# EAGLE design main (EAGLE 6.6.0)
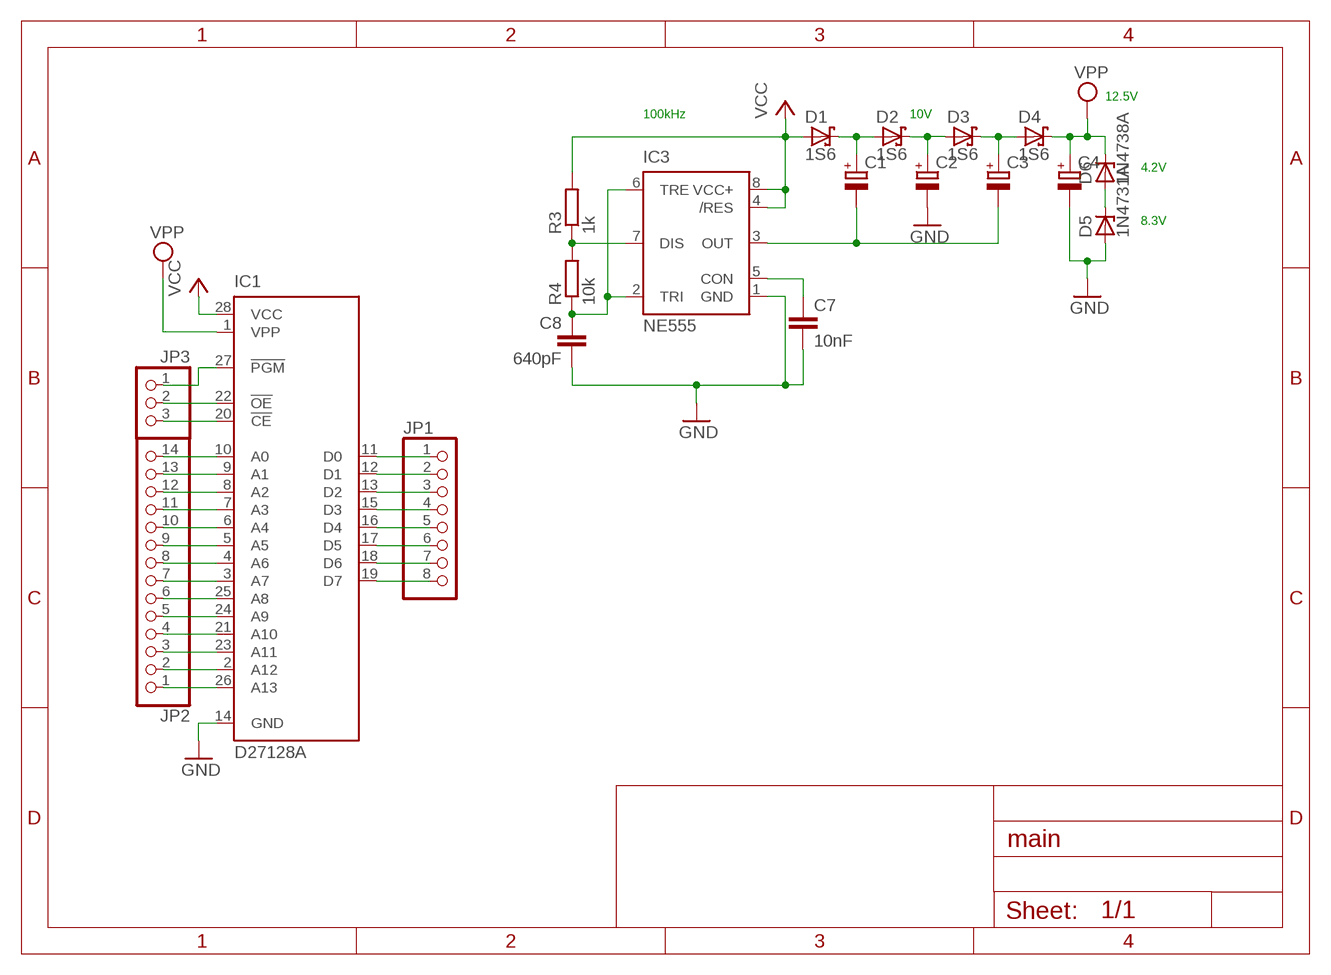
[diagram p0: schematic, sheet 1]

## Parts
C1  CPOL-EUB45181A  [B45181A]
C2  CPOL-EUB45181A  [B45181A]
C3  CPOL-EUB45181A  [B45181A]
C4  CPOL-EUB45181A  [B45181A]
C7  10nF  C-EU025-025X050  [C025-025X050]
C8  640pF  C-EU025-025X050  [C025-025X050]
D1  1S6  1N5817-B  [DO41-7.6]
D2  1S6  1N5817-B  [DO41-7.6]
D3  1S6  1N5817-B  [DO41-7.6]
D4  1S6  1N5817-B  [DO41-7.6]
D5  1N4731A  1N4728  [DO41Z10]
D6  1N4738A  1N4728  [DO41Z10]
IC1  D27128A  27C128P  [DIL28-6]
IC3  NE555  [DIL-08]
JP1  PINHD-1X8  [1X08]
JP2  PINHD-1X14  [1X14]
JP3  PINHD-1X3  [1X03]
R3  1k  R-EU_0204/7  [0204/7]
R4  10k  R-EU_0204/7  [0204/7]

## Nets
GND: C2.- C4.- C7.2 C8.2 D5.A IC1.14(GND) IC3.1(GND)
N$1: IC1.11(D0) JP1.1
N$2: IC1.12(D1) JP1.2
N$3: IC1.13(D2) JP1.3
N$4: IC1.15(D3) JP1.4
N$5: IC1.16(D4) JP1.5
N$6: IC1.17(D5) JP1.6
N$7: IC1.18(D6) JP1.7
N$8: IC1.19(D7) JP1.8
N$9: IC1.10(A0) JP2.14
N$10: IC1.9(A1) JP2.13
N$11: IC1.8(A2) JP2.12
N$12: IC1.7(A3) JP2.11
N$13: IC1.6(A4) JP2.10
N$14: IC1.5(A5) JP2.9
N$15: IC1.4(A6) JP2.8
N$16: IC1.3(A7) JP2.7
N$17: IC1.25(A8) JP2.6
N$18: IC1.24(A9) JP2.5
N$19: IC1.21(A10) JP2.4
N$20: IC1.23(A11) JP2.3
N$21: IC1.2(A12) JP2.2
N$22: IC1.26(A13) JP2.1
N$23: C1.- C3.- IC3.3(OUT)
N$24: C3.+ D3.C D4.A
N$25: IC1.20(!CE) JP3.3
N$27: D5.C D6.A
N$28: IC1.22(!OE) JP3.2
N$29: IC1.27(!PGM) JP3.1
N$30: C7.1 IC3.5(CON)
N$32: C8.1 IC3.2(TRI) IC3.6(TRE) R4.1
N$34: C1.+ D1.C D2.A
N$36: C2.+ D2.C D3.A
N$40: IC3.7(DIS) R3.1 R4.2
VCC: D1.A IC1.28(VCC) IC3.4(/RES) IC3.8(VCC+) R3.2
VPP: C4.+ D4.C D6.C IC1.1(VPP)

## Notes on the sheet
- 12.5V
- 100kHz | 10V
- 4.2V
- 8.3V

## Library data of the parts
C1-C4 = rcl:CPOL-EU: POLARIZED CAPACITOR, European symbol
C7 C8 = rcl:C-EU: CAPACITOR, European symbol
D1-D4 = diode:1N581*: 1.0A SCHOTTKY BARRIER RECTIFIER Source: http://www.diodes.com/datasheets/ds23001.pdf
D5 D6 = diode:1N4728: Z DIODE 3.3 V, 1W, 5 percent
IC1 = microchip:27*128: CMOS EPROM 128 K (16 K x 8); OC_FARNELL: unknown; OC_NEWARK: unknown
IC3 = st-microelectronics:NE555: General purpose bipolar Timer; MF: Arrow Electronics; MPN: NE555N; OC_FARNELL: 1467742; OC_NEWARK: 89K1486
JP1 = pinhead:PINHD-1X8: PIN HEADER
JP2 = pinhead:PINHD-1X14: PIN HEADER
JP3 = pinhead:PINHD-1X3: PIN HEADER
R3 R4 = rcl:R-EU_: RESISTOR, European symbol

## Board
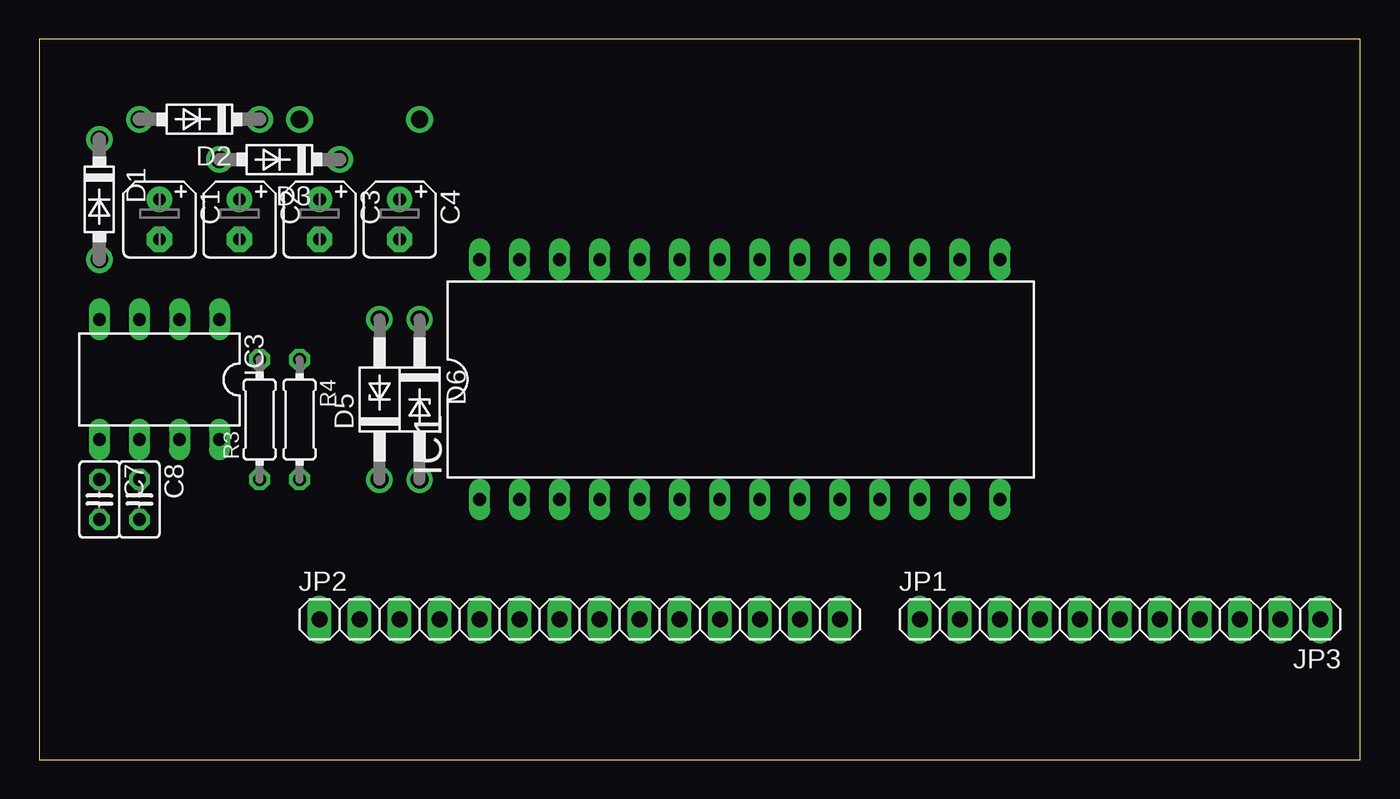
[diagram p1: board, top side]
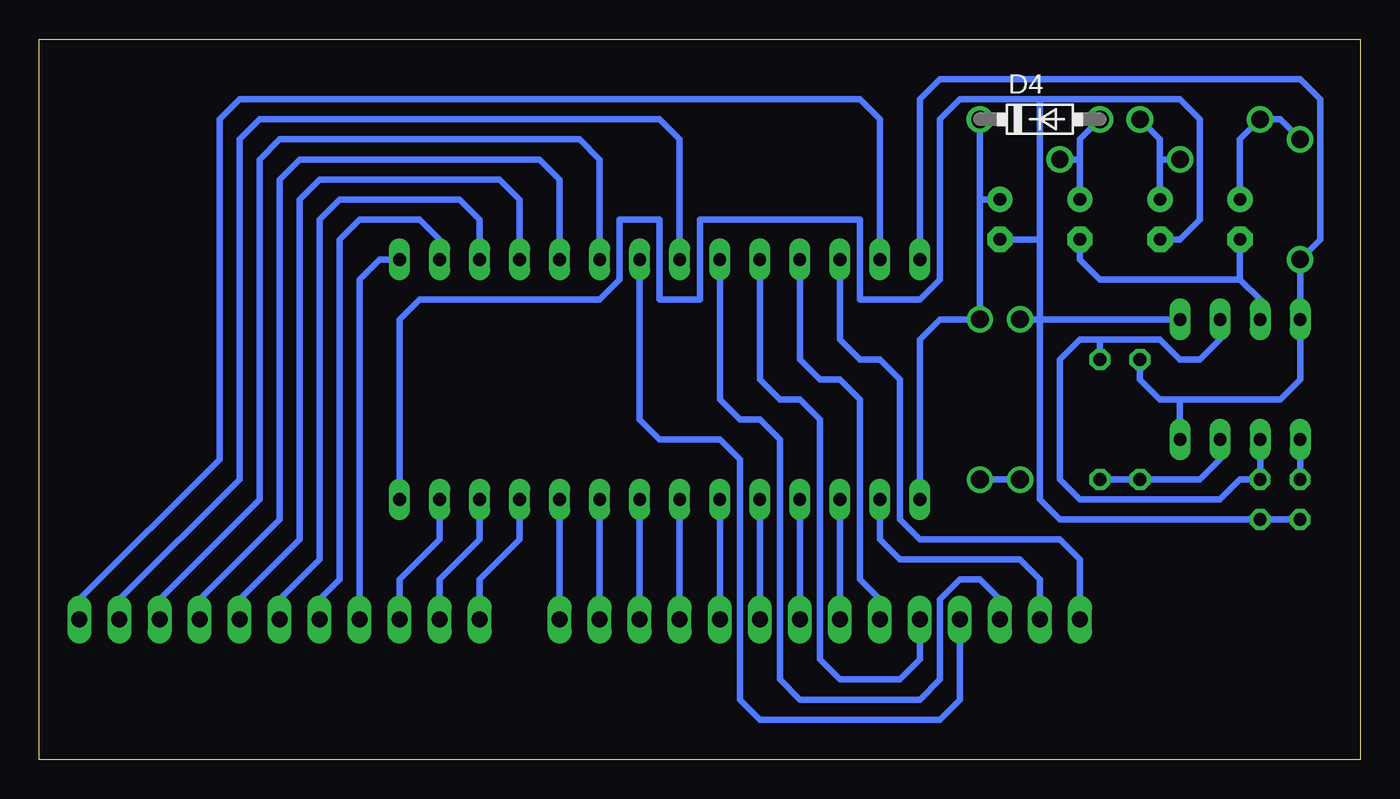
[diagram p2: board, bottom side, seen from below]

Size 83.82 x 45.72 mm. Coordinates in mm from the lower left corner, seen from the top.
Outline: 0,0 83.82,0 83.82,45.72 0,45.72 0,0
Copper layers (1*16): Top 0.035mm / dielectric 1.5mm / Bottom 0.035mm
Design rules "default": minimum track width 10mil, minimum drill 24mil, track to track 8mil, track to pad 8mil, pad to pad 8mil, via to via 8mil, smd to smd 8mil, copper to edge 40mil, drill to drill 8mil, minimum pad ring 10mil, minimum via ring 8mil, stop-mask expansion 4mil, vias tented up to drill 0mil, thermal gap 10mil

### Footprints (pad centres in the part's own frame; a part is rotated, then mirrored left to right if it is on the bottom)
B45181A = drill 0.813 pad 1.6: + -1.27,0 | drill 0.813 pad 1.6 octagon: - 1.27,0
C025-025X050 = drill 0.813 octagon: 1 -1.27,0; 2 1.27,0
DO41-7.6 = drill 1.1 pad 1.7: A 3.81,0; C -3.81,0
DO41Z10 = drill 1.118: A 5.08,0; C -5.08,0
DIL28-6 = drill 0.813 long: 1 -16.51,-7.62; 2 -13.97,-7.62; 3 -11.43,-7.62; 4 -8.89,-7.62; 5 -6.35,-7.62; 6 -3.81,-7.62; 7 -1.27,-7.62; 8 1.27,-7.62; 9 3.81,-7.62; 10 6.35,-7.62; 11 8.89,-7.62; 12 11.43,-7.62; 13 13.97,-7.62; 14 16.51,-7.62; 15 16.51,7.62; 16 13.97,7.62; 17 11.43,7.62; 18 8.89,7.62; 19 6.35,7.62; 20 3.81,7.62; 21 1.27,7.62; 22 -1.27,7.62; 23 -3.81,7.62; 24 -6.35,7.62; 25 -8.89,7.62; 26 -11.43,7.62; 27 -13.97,7.62; 28 -16.51,7.62
DIL-08 = drill 0.813 long: 1 -3.81,-3.81; 2 -1.27,-3.81; 3 1.27,-3.81; 4 3.81,-3.81; 5 3.81,3.81; 6 1.27,3.81; 7 -1.27,3.81; 8 -3.81,3.81
1X08 = drill 1.016 long: 1 -8.89,0; 2 -6.35,0; 3 -3.81,0; 4 -1.27,0; 5 1.27,0; 6 3.81,0; 7 6.35,0; 8 8.89,0
1X14 = drill 1.016 long: 1 -16.51,0; 2 -13.97,0; 3 -11.43,0; 4 -8.89,0; 5 -6.35,0; 6 -3.81,0; 7 -1.27,0; 8 1.27,0; 9 3.81,0; 10 6.35,0; 11 8.89,0; 12 11.43,0; 13 13.97,0; 14 16.51,0
1X03 = drill 1.016 long: 1 -2.54,0; 2 0,0; 3 2.54,0
0204/7 = drill 0.813 octagon: 1 -3.81,0; 2 3.81,0

### Placement (x,y rotation side)
C1  7.62,34.29 270 top
C2  12.7,34.29 270 top
C3  17.78,34.29 270 top
C4  22.86,34.29 270 top
C7  3.81,16.51 270 top
C8  6.35,16.51 270 top
D1  3.81,35.56 270 top
D2  10.16,40.64 180 top
D3  15.24,38.1 180 top
D4  20.32,40.64 0 bottom
D5  21.59,22.86 90 top
D6  24.13,22.86 270 top
IC1  44.45,24.13 0 top
IC3  7.62,24.13 180 top
JP1  64.77,8.89 0 top
JP2  34.29,8.89 0 top
JP3  78.74,8.89 180 top
R3  13.97,21.59 90 top
R4  16.51,21.59 270 top

### Tracks (layer width: path | path; a pad name or v marks a point on that pad's centre or on a via)
GND
  Bottom 0.406: C2.- 11.43,33.02 10.16,34.29 10.16,40.64 11.43,41.91 20.32,41.91 | 20.32,41.91 20.32,34.29 20.32,33.02 | C4.- 20.32,33.02 | 20.32,33.02 20.32,27.94 | 20.32,27.94 D5.A | IC3.1 20.32,27.94 | C7.2 C8.2 19.05,15.24 20.32,16.51 20.32,27.94 | IC1.14 60.96,27.94 59.69,29.21 48.26,29.21 46.99,30.48 46.99,34.29 44.45,34.29 44.45,29.21 41.91,29.21 41.91,34.29 31.75,34.29 31.75,29.21 27.94,29.21 26.67,30.48 26.67,40.64 25.4,41.91 20.32,41.91
N$1
  Bottom 0.406: IC1.11 53.34,13.97 55.88,11.43 JP1.1
N$2
  Bottom 0.406: IC1.12 55.88,13.97 58.42,11.43 JP1.2
N$3
  Bottom 0.406: JP1.3 60.96,11.43 58.42,13.97 IC1.13
N$4
  Bottom 0.406: JP1.4 63.5,30.48 62.23,31.75 IC1.15
N$5
  Bottom 0.406: JP1.5 66.04,10.16 64.77,11.43 64.77,33.02 63.5,34.29 59.69,34.29 58.42,33.02 IC1.16
N$6
  Bottom 0.406: JP1.6 68.58,10.16 66.04,12.7 66.04,34.29 64.77,35.56 57.15,35.56 55.88,34.29 IC1.17
N$7
  Bottom 0.406: JP1.7 71.12,10.16 67.31,13.97 67.31,35.56 66.04,36.83 54.61,36.83 53.34,35.56 IC1.18
N$8
  Bottom 0.406: JP1.8 73.66,10.16 68.58,15.24 68.58,36.83 67.31,38.1 52.07,38.1 50.8,36.83 IC1.19
N$9
  Bottom 0.406: IC1.10 JP2.14
N$10
  Bottom 0.406: IC1.9 JP2.13
N$11
  Bottom 0.406: IC1.8 JP2.12
N$12
  Bottom 0.406: JP2.11 IC1.7
N$13
  Bottom 0.406: IC1.6 JP2.10
N$14
  Bottom 0.406: JP2.9 IC1.5
N$15
  Bottom 0.406: IC1.4 JP2.8
N$16
  Bottom 0.406: JP2.7 IC1.3
N$17
  Bottom 0.406: IC1.25 35.56,25.4 34.29,24.13 33.02,24.13 31.75,22.86 31.75,11.43 30.48,10.16 JP2.6
N$18
  Bottom 0.406: IC1.24 38.1,24.13 36.83,22.86 35.56,22.86 34.29,21.59 34.29,6.35 33.02,5.08 29.21,5.08 27.94,6.35 JP2.5
N$19
  Bottom 0.406: JP2.4 25.4,3.81 26.67,2.54 38.1,2.54 39.37,3.81 39.37,19.05 40.64,20.32 44.45,20.32 45.72,21.59 IC1.21
N$20
  Bottom 0.406: IC1.23 40.64,22.86 39.37,21.59 38.1,21.59 36.83,20.32 36.83,5.08 35.56,3.81 27.94,3.81 26.67,5.08 26.67,10.16 25.4,11.43 24.13,11.43 22.86,10.16 JP2.3
N$21
  Bottom 0.406: IC1.2 30.48,13.97 29.21,12.7 21.59,12.7 20.32,11.43 JP2.2
N$22
  Bottom 0.406: JP2.1 17.78,12.7 19.05,13.97 27.94,13.97 29.21,15.24 29.21,24.13 30.48,25.4 31.75,25.4 33.02,26.67 IC1.26
N$23
  Bottom 0.406: C3.- 17.78,31.75 16.51,30.48 7.62,30.48 | 7.62,30.48 C1.- | IC3.3 6.35,29.21 7.62,30.48
N$24
  Bottom 0.406: 17.78,38.1 C3.+ | D4.A 17.78,39.37 17.78,38.1 | 17.78,38.1 D3.C
N$25
  Bottom 0.406: IC1.20 48.26,38.1 49.53,39.37 68.58,39.37 69.85,38.1 69.85,16.51 76.2,10.16 JP3.3
N$27
  Bottom 0.406: D6.A D5.C
N$28
  Bottom 0.406: JP3.2 78.74,10.16 71.12,17.78 71.12,39.37 69.85,40.64 44.45,40.64 43.18,39.37 IC1.22
N$29
  Bottom 0.406: JP3.1 81.28,10.16 72.39,19.05 72.39,40.64 71.12,41.91 31.75,41.91 30.48,40.64 IC1.27
N$30
  Bottom 0.406: C7.1 IC3.5
N$32
  Bottom 0.406: IC3.6 C8.1 7.62,17.78 8.89,16.51 17.78,16.51 19.05,17.78 19.05,25.4 17.78,26.67 16.51,26.67 | IC3.2 8.89,26.67 10.16,25.4 11.43,25.4 12.7,26.67 16.51,26.67 | R4.1 16.51,26.67
N$34
  Bottom 0.406: C1.+ 7.62,39.37 D2.A 5.08,40.64 D1.C
N$36
  Bottom 0.406: D2.C 12.7,39.37 12.7,38.1 | D3.A 12.7,38.1 | 12.7,38.1 C2.+
N$40
  Bottom 0.406: R4.2 R3.1 10.16,17.78 8.89,19.05 IC3.7
VCC
  Bottom 0.406: IC3.8 11.43,22.86 | 11.43,22.86 5.08,22.86 3.81,24.13 IC3.4 D1.A 2.54,33.02 2.54,41.91 3.81,43.18 26.67,43.18 27.94,41.91 IC1.28 | 11.43,22.86 12.7,22.86 13.97,24.13 R3.2
VPP
  Bottom 0.406: 24.13,35.56 C4.+ 24.13,35.56 | 24.13,35.56 D4.C | 24.13,35.56 D6.C 26.67,27.94 27.94,26.67 IC1.1